# EAGLE design 165EVAL_REV.B (EAGLE 6.6.0)
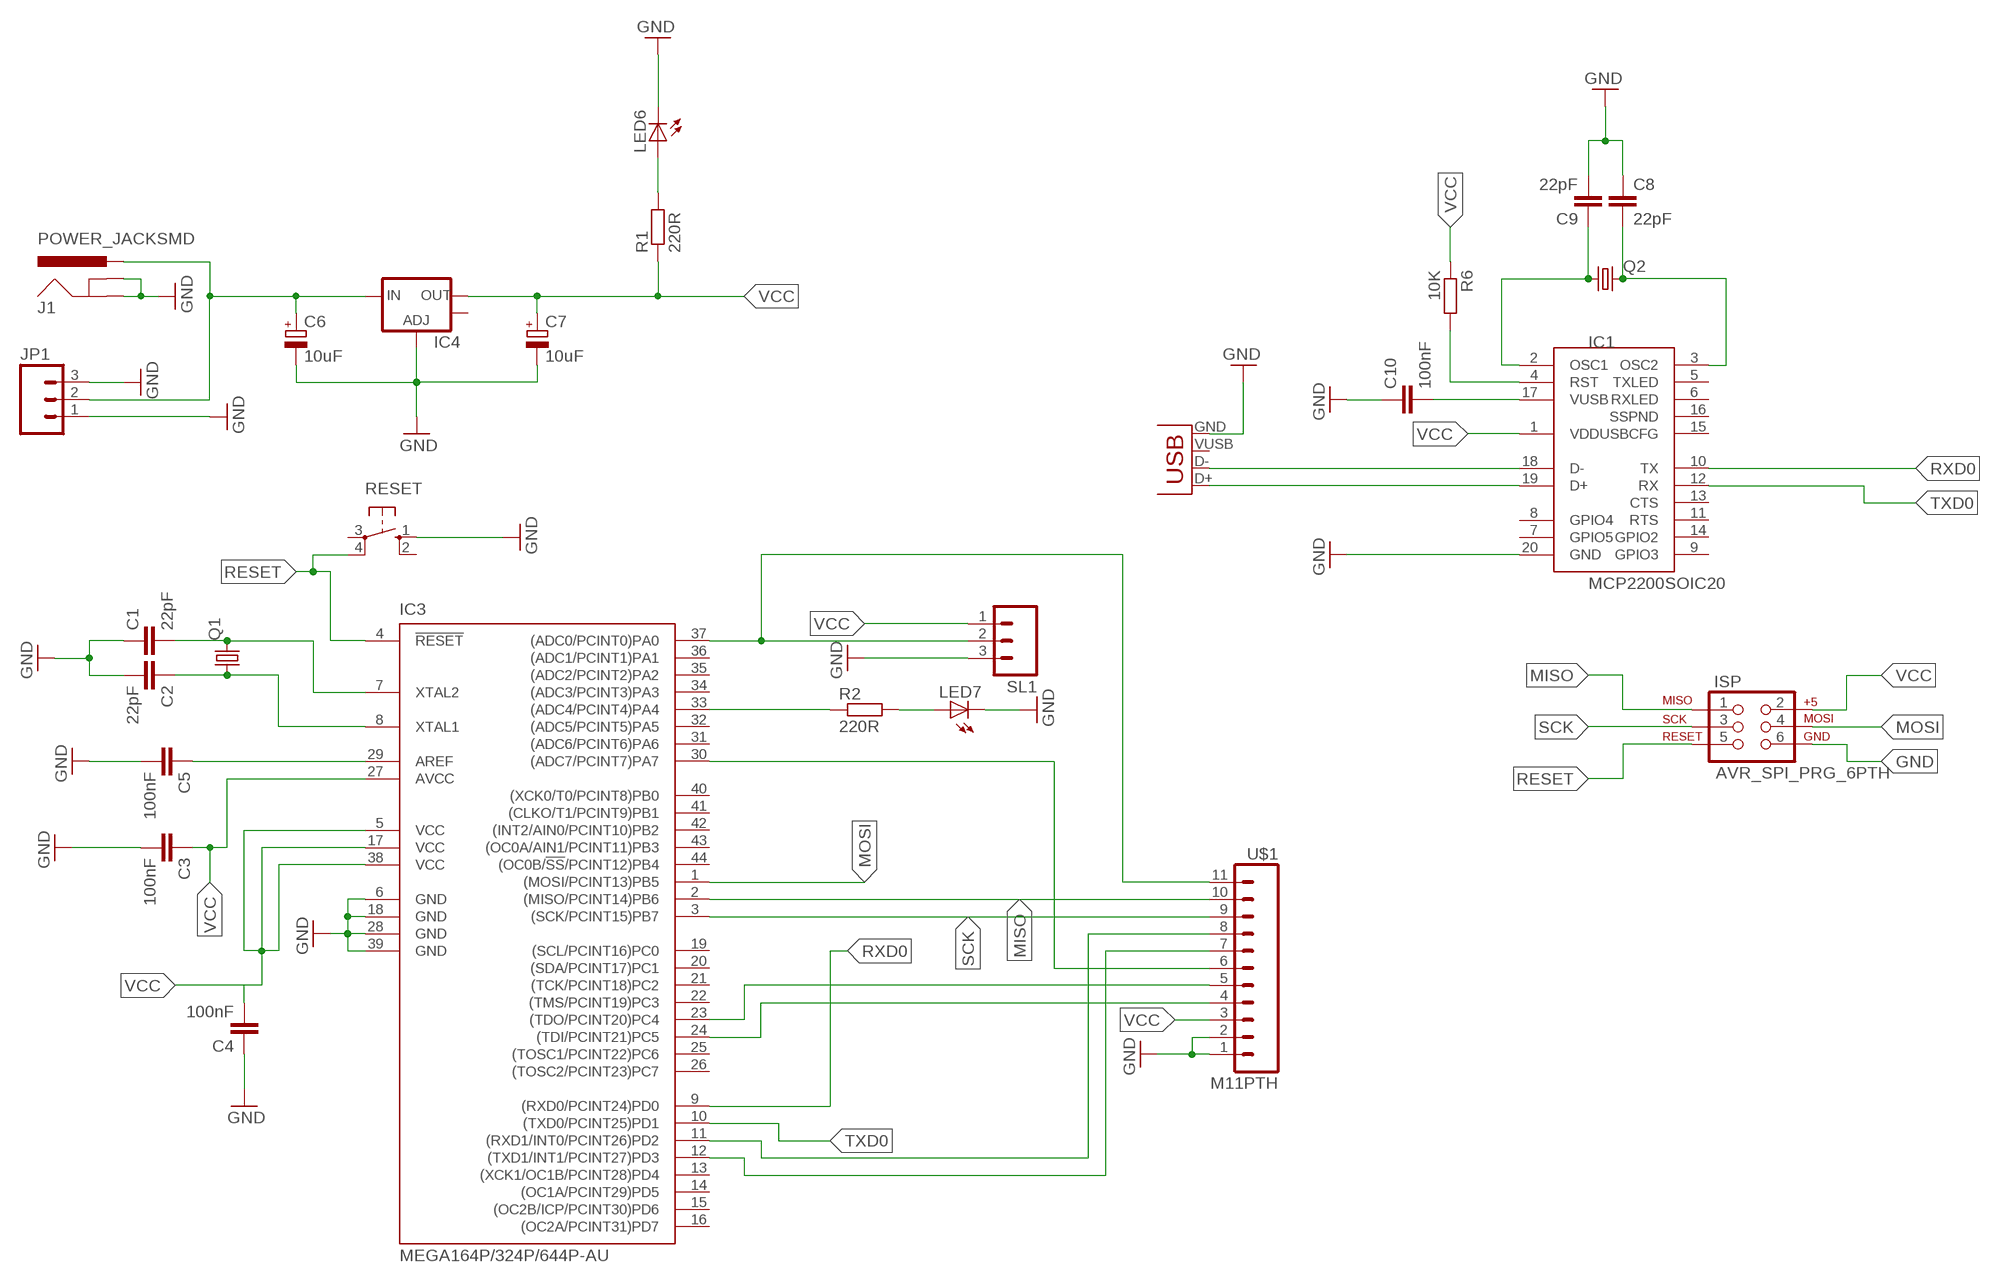
[diagram p0: schematic, sheet 1]

## Parts
C1  22pF  C-EUC0805K  [C0805K]
C2  22pF  C-EUC0805K  [C0805K]
C3  100nF  C-EUC0805K  [C0805K]
C4  100nF  C-EUC0805K  [C0805K]
C5  100nF  C-EUC0805K  [C0805K]
C6  10uF  CPOL-EUCT6032  [CT6032]
C7  10uF  CPOL-EUCT6032  [CT6032]
C8  22pF  C-EUC0805K  [C0805K]
C9  22pF  C-EUC0805K  [C0805K]
C10  100nF  C-EUC0805K  [C0805K]
IC1  MCP2200SOIC20  [SOIC20]
IC3  MEGA164P/324P/644P-AU  [TQFP44]
IC4  V_REG_LM1117SOT223  [SOT223]
ISP  AVR_SPI_PRG_6PTH  [2X3]
J1  POWER_JACKSMD  [POWER_JACK_SMD]
JP1  M03PTH  [1X03]
LED6  LEDSMT1206  [1206]
LED7  LEDSMT1206  [1206]
Q1  CRYSTALSM49  [SM49]
Q2  CRYSTALSM49  [SM49]
R1  220R  R-EU_R1206  [R1206]
R2  220R  R-EU_R1206  [R1206]
R6  10K  R-EU_R1206  [R1206]
RESET  10-XX  [B3F-10XX]
SL1  M03  [03P]
U$1  M11PTH  [1X11]
USB  USB-B-S  [USB-B-SMT]

## Nets
GND: C1.1 C2.2 C3.2 C4.1 C5.2 C6.- C7.- C8.1 C9.2 C10.1 IC1.20(GND) IC3.6(GND) IC3.18(GND) IC3.28(GND) IC3.39(GND) IC4.1(ADJ) ISP.6 J1.GND(GNDBREAK) J1.P$4(GND) JP1.1 JP1.3 LED6.C LED7.C RESET.1(S) SL1.3 U$1.1 U$1.2 USB.GND
MISO: IC3.2((MISO/PCINT14)PB6) ISP.1 U$1.10
MOSI: IC3.1((MOSI/PCINT13)PB5) ISP.4
N$1: C1.2 IC3.7(XTAL2) Q1.2
N$2: C2.1 IC3.8(XTAL1) Q1.1
N$3: C8.2 IC1.3(OSC2) Q2.2
N$4: C9.1 IC1.2(OSC1) Q2.1
N$5: IC3.37((ADC0/PCINT0)PA0) SL1.2 U$1.11
N$6: C5.1 IC3.29(AREF)
N$7: C10.2 IC1.17(VUSB)
N$9: IC1.18(D-) USB.D-
N$10: IC1.19(D+) USB.D+
N$11: IC1.4(RST) R6.2
N$12: IC3.33((ADC4/PCINT4)PA4) R2.1
N$13: IC3.11((RXD1/INT0/PCINT26)PD2) U$1.8
N$14: IC3.12((TXD1/INT1/PCINT27)PD3) U$1.7
N$15: IC3.30((ADC7/PCINT7)PA7) U$1.6
N$16: IC3.23((TDO/PCINT20)PC4) U$1.5
N$17: IC3.24((TDI/PCINT21)PC5) U$1.4
N$30: C6.+ IC4.3(IN) J1.VIN0(PWR) JP1.2
N$36: LED6.A R1.2
N$37: LED7.A R2.2
RESET: IC3.4(!RESET) ISP.5 RESET.4(P1)
RXD0: IC1.10(TX) IC3.9((RXD0/PCINT24)PD0)
SCK: IC3.3((SCK/PCINT15)PB7) ISP.3 U$1.9
TXD0: IC1.12(RX) IC3.10((TXD0/PCINT25)PD1)
VCC: C3.1 C4.2 C7.+ IC1.1(VDD) IC3.5(VCC) IC3.17(VCC) IC3.27(AVCC) IC3.38(VCC) IC4.2(OUT) ISP.2 R1.1 R6.1 SL1.1 U$1.3
Unconnected: IC1.5(TXLED) IC1.6(RXLED) IC1.7(GPIO5) IC1.8(GPIO4) IC1.9(GPIO3) IC1.11(RTS) IC1.13(CTS) IC1.14(GPIO2) IC1.15(USBCFG) IC1.16(SSPND) IC3.13((XCK1/OC1B/PCINT28)PD4) IC3.14((OC1A/PCINT29)PD5) IC3.15((OC2B/ICP/PCINT30)PD6) IC3.16((OC2A/PCINT31)PD7) IC3.19((SCL/PCINT16)PC0) IC3.20((SDA/PCINT17)PC1) IC3.21((TCK/PCINT18)PC2) IC3.22((TMS/PCINT19)PC3) IC3.25((TOSC1/PCINT22)PC6) IC3.26((TOSC2/PCINT23)PC7) IC3.31((ADC6/PCINT6)PA6) IC3.32((ADC5/PCINT5)PA5) IC3.34((ADC3/PCINT3)PA3) IC3.35((ADC2/PCINT2)PA2) IC3.36((ADC1/PCINT1)PA1) IC3.40((XCK0/T0/PCINT8)PB0) IC3.41((CLKO/T1/PCINT9)PB1) IC3.42((INT2/AIN0/PCINT10)PB2) IC3.43((OC0A/AIN1/PCINT11)PB3) IC3.44((OC0B/!SS!/PCINT12)PB4) IC4.4(OUT) RESET.2(S1) RESET.3(P) USB.VUSB(VBUS)

## Library data of the parts
C1-C5 C8-C10 = rcl:C-EU: CAPACITOR, European symbol
C6 C7 = resistor:CPOL-EU: POLARIZED CAPACITOR, European symbol
IC1 = microchip-update-2:MCP2200: USB 2.0 to UART Protocol Converter with GPIO
IC3 = avr-7:MEGA164P/324P/644P-AU
IC4 = SparkFun:V_REG_LM1117: Voltage Regulator LM1117 Standard adjustable voltage regulator but in SMD form. Spark Fun Electronics SKU : COM-00595
ISP = SparkFun:AVR_SPI_PRG_6: AVR ISP 6 Pin This is the reduced ISP connector for AVR programming. Common on Arduino. This footprint will take up less PCB space and can be used with a 10-pin to 6-pin adapter such as SKU: BOB-08508
J1 = SparkFun:POWER_JACK: Power Jack This is the standard 5.5mm barrel jack for power. The PTH is the most common, proven, reliable, footprint. All others are experimental. The Slot footprint only works if the mill layer is transmitted to the PCB fab house so be warned. Spark Fun Electronics SKU : PRT-00119. Mating wall wart : TOL-00298 (and others)
JP1 = SparkFun:M03: Header 3 Standard 3-pin 0.1" header. Use with straight break away headers (SKU : PRT-00116), right angle break away headers (PRT-00553), swiss pins (PRT-00743), machine pins (PRT-00117), and female headers (PRT-00115). Molex polarized connector foot print use with SKU : PRT-08232 with associated crimp pins and housings.
LED6 LED7 = led:LED: LED OSRAM: - CHIPLED LG R971, LG N971, LY N971, LG Q971, LY Q971, LO R971, LY R971 LH N974, LH R974 LS Q976, LO Q976, LY Q976 LO Q996 - Hyper CHIPLED LW Q18S LB Q993, LB Q99A, LB R99A - SideLED LS A670, LO A670, LY A670, LG A670, LP A670 LB A673, LV A673, LT A673, LW A673 LH A674 LY A675 LS A676, LA A676, LO A676, LY A676, LW A676 LS A679, LY A679, LG A679 - Hyper Micro SIDELED® LS Y876, LA Y876, LO Y876, LY Y876 LT Y87S - SmartLED LW L88C, LW L88S LB L89C, LB L89S, LG L890 LS L89K, LO L89K, LY L89K LS L896, LA L896, LO L896, LY L896 - TOPLED LS T670, LO T670, LY T670, LG T670, LP T670 LSG T670, LSP T670, LSY T670, LOP T670, LYG T670 LG T671, LOG T671, LSG T671 LB T673, LV T673, LT T673, LW T673 LH T674 LS T676, LA T676, LO T676, LY T676, LB T676, LH T676, LSB T676, LW T676 LB T67C, LV T67C, LT T67C, LS T67K, LO T67K, LY T67K, LW E67C LS E67B, LA E67B, LO E67B, LY E67B, LB E67C, LV E67C, LT E67C LW T67C LS T679, LY T679, LG T679 LS T770, LO T770, LY T770, LG T770, LP T770 LB T773, LV T773, LT T773, LW T773 LH T774 LS E675, LA E675, LY E675, LS T675 LS T776, LA T776, LO T776, LY T776, LB T776 LHGB T686 LT T68C, LB T68C - Hyper Mini TOPLED® LB M676 - Mini TOPLED Santana® LG M470 LS M47K, LO M47K, LY M47K Source: http://www.osram.convergy.de LUXEON: - LUMILED® LXK2-PW12-R00, LXK2-PW12-S00, LXK2-PW14-U00, LXK2-PW14-V00 LXK2-PM12-R00, LXK2-PM12-S00, LXK2-PM14-U00 LXK2-PE12-Q00, LXK2-PE12-R00, LXK2-PE12-S00, LXK2-PE14-T00, LXK2-PE14-U00 LXK2-PB12-K00, LXK2-PB12-L00, LXK2-PB12-M00, LXK2-PB14-N00, LXK2-PB14-P00, LXK2-PB14-Q00 LXK2-PR12-L00, LXK2-PR12-M00, LXK2-PR14-Q00, LXK2-PR14-R00 LXK2-PD12-Q00, LXK2-PD12-R00, LXK2-PD12-S00 LXK2-PH12-R00, LXK2-PH12-S00 LXK2-PL12-P00, LXK2-PL12-Q00, LXK2-PL12-R00 Source: www.luxeon.com KINGBRIGHT: KA-3528ASYC Source: www.kingbright.com
Q1 Q2 = crystal:CRYSTAL: CRYSTAL; OC_FARNELL: unknown; OC_NEWARK: unknown
R1 R2 R6 = resistor:R-EU_: RESISTOR, European symbol
RESET = switch-omron:10-XX: OMRON SWITCH; MPN: B3F-1000; OC_FARNELL: 176432; OC_NEWARK: 36M3542
SL1 = con-amp-quick:M03: AMP QUICK CONNECTOR; OC_FARNELL: unknown; OC_NEWARK: unknown
U$1 = SparkFun-3-2-07:M11: Header 11 Standard 11-pin 0.1" header. Use with straight break away headers (SKU : PType-HD), right angle break away headers (PType-HD-RightAngle), swiss pins (PType-30F), machine pins (PType-MP), and female headers (PType-FH). Molex polarized connector foot print use with SKU : Con-Hdr with associated crimp pins and housings.
USB = SparkFun:USB: USB Connectors USB-B-PTH is fully proven SKU : PRT-00139 USB-miniB is fully proven SKU : PRT-00587 USB-A-PCB is untested. USB-A-H is throughly reviewed, but untested. Spark Fun Electronics SKU : PRT-00437 USB-B-SMT is throughly reviewed, but untested. Needs silkscreen touching up. USB-A-S has not been used/tested USB-MB-H has not been used/tested

## Net classes
1 vcc: width 0.254 mm

## Board
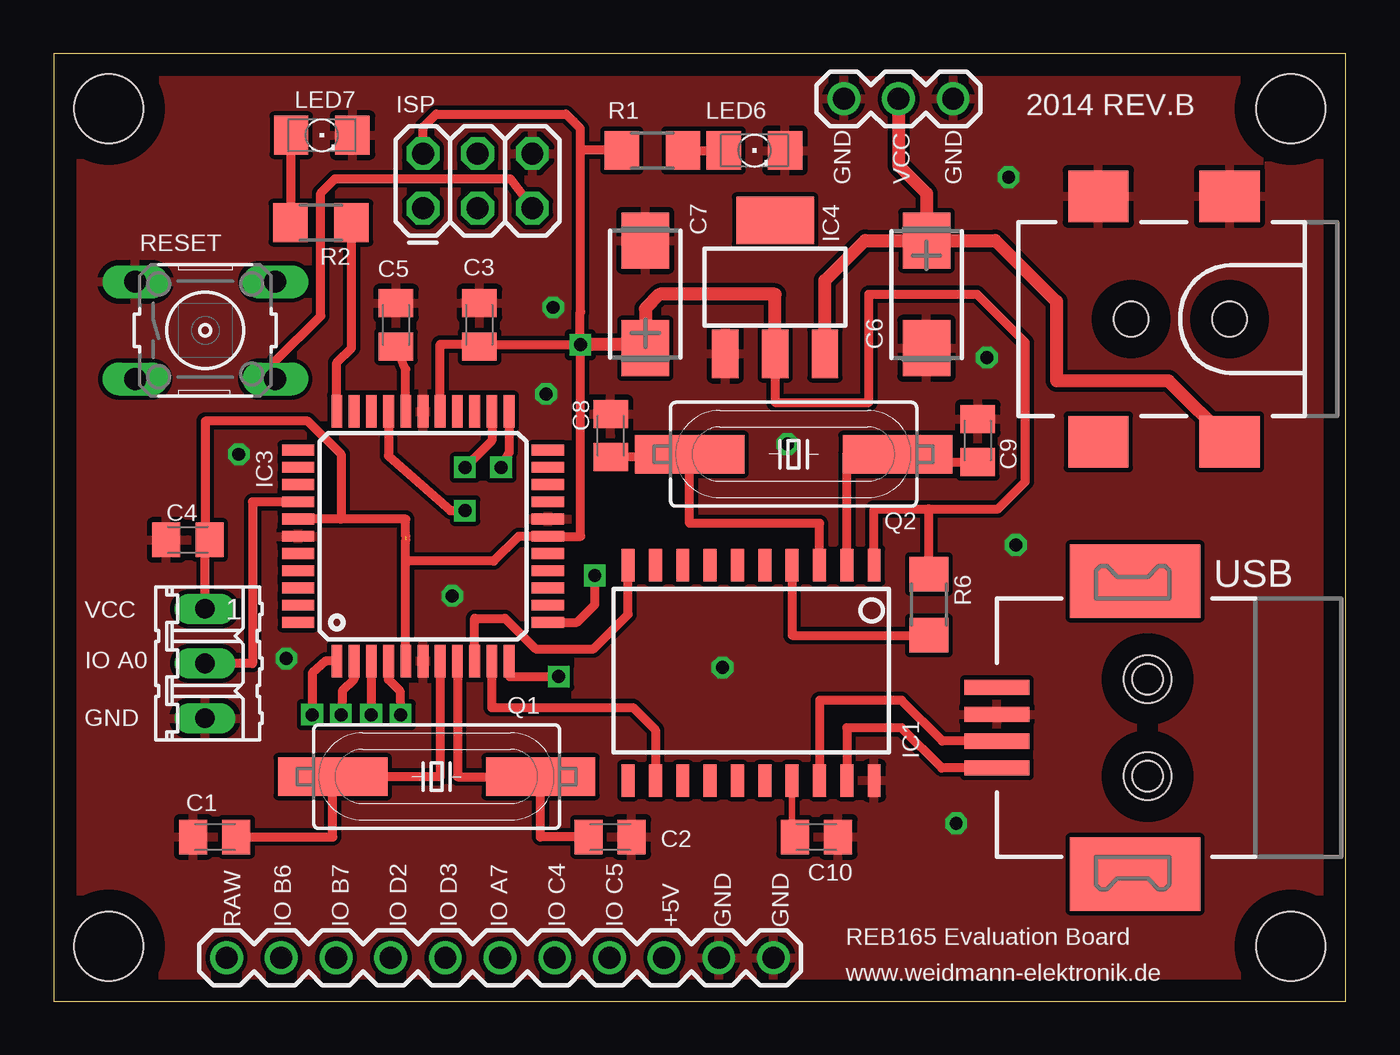
[diagram p1: board, top side]
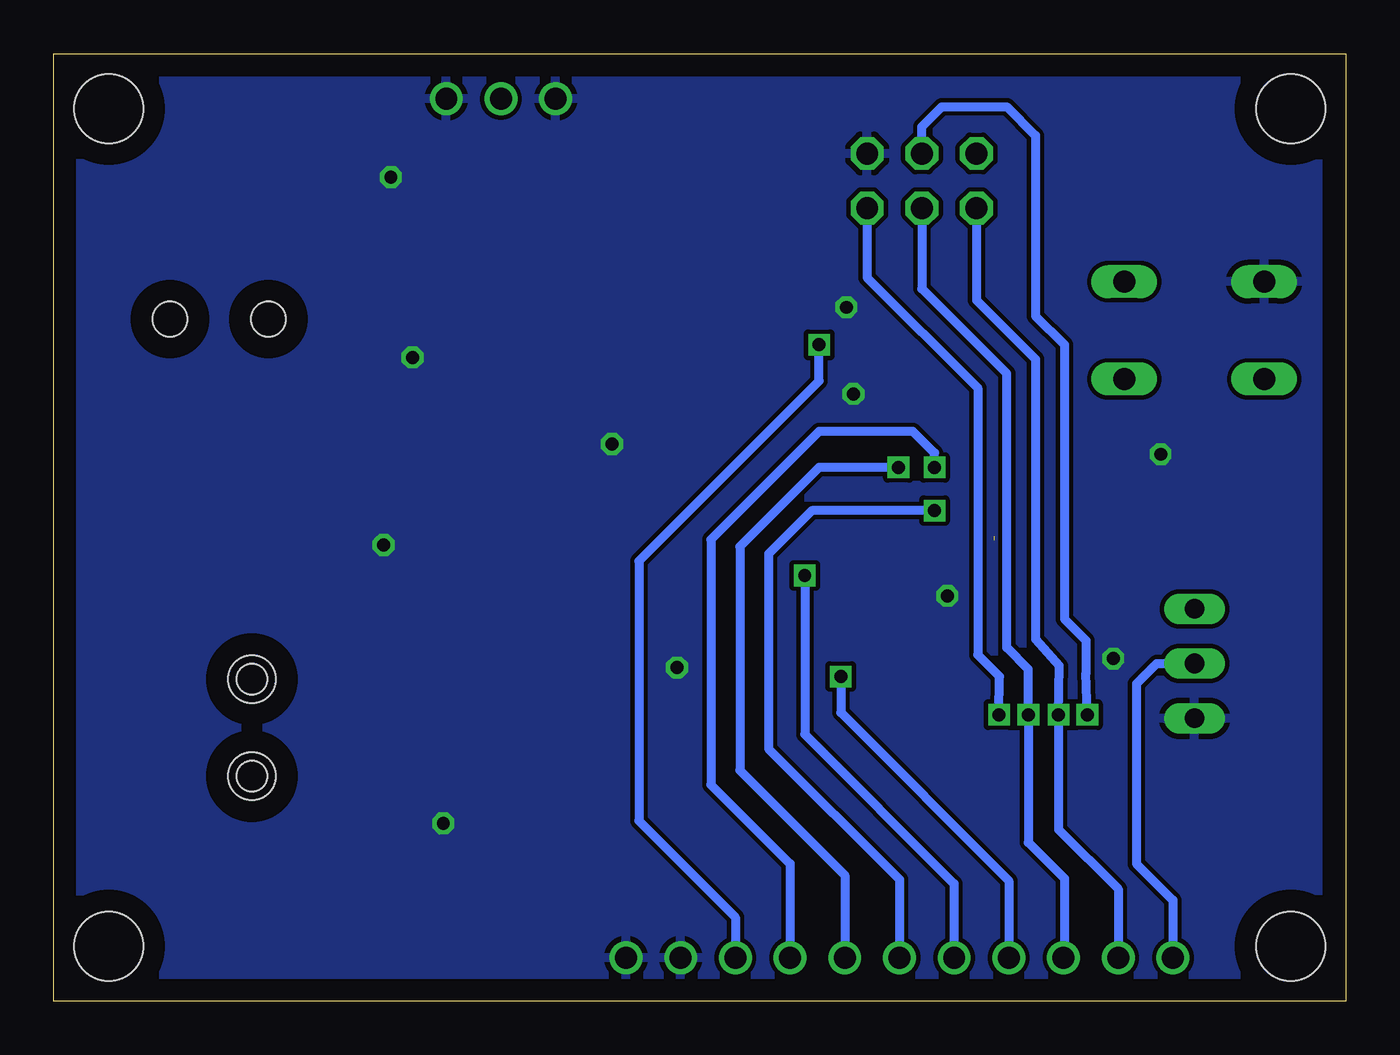
[diagram p2: board, bottom side, seen from below]

Size 60 x 44 mm. Coordinates in mm from the lower left corner, seen from the top.
Outline: 0,0 60,0 60,44 0,44 0,0
Copper layers (1*16): Top 0.035mm / dielectric 1.5mm / Bottom 0.035mm
Design rules "default": minimum track width 10mil, minimum drill 24mil, track to track 8mil, track to pad 8mil, pad to pad 8mil, via to via 8mil, smd to smd 8mil, copper to edge 40mil, drill to drill 8mil, minimum pad ring 10mil, minimum via ring 8mil, stop-mask expansion 4mil, vias tented up to drill 0mil, thermal gap 10mil
Holes 3.2 mm at 57.46,2.54 2.54,2.54 2.54,41.46 57.46,41.46
Holes 2.2 mm at 50.8,14.95 50.8,10.45

### Footprints (pad centres in the part's own frame; a part is rotated, then mirrored left to right if it is on the bottom)
C0805K = smd 1.3 x 1.6: 1 -1,0; 2 1,0
CT6032 = smd 2.6 x 2.2: + 2.5,0; - -2.5,0
SOIC20 = smd 0.6 x 1.5: 1 -5.715,-5; 2 -4.445,-5; 3 -3.175,-5; 4 -1.905,-5; 5 -0.635,-5; 6 0.635,-5; 7 1.905,-5; 8 3.175,-5; 9 4.445,-5; 10 5.715,-5; 11 5.715,5; 12 4.445,5; 13 3.175,5; 14 1.905,5; 15 0.635,5; 16 -0.635,5; 17 -1.905,5; 18 -3.175,5; 19 -4.445,5; 20 -5.715,5
TQFP44 = smd 1.5 x 0.5: 1 -5.8,4; 2 -5.8,3.2; 3 -5.8,2.4; 4 -5.8,1.6; 5 -5.8,0.8; 6 -5.8,0; 7 -5.8,-0.8; 8 -5.8,-1.6; 9 -5.8,-2.4; 10 -5.8,-3.2; 11 -5.8,-4; 23 5.8,-4; 24 5.8,-3.2; 25 5.8,-2.4; 26 5.8,-1.6; 27 5.8,-0.8; 28 5.8,0; 29 5.8,0.8; 30 5.8,1.6; 31 5.8,2.4; 32 5.8,3.2; 33 5.8,4 | smd 0.5 x 1.5: 12 -4,-5.8; 13 -3.2,-5.8; 14 -2.4,-5.8; 15 -1.6,-5.8; 16 -0.8,-5.8; 17 0,-5.8; 18 0.8,-5.8; 19 1.6,-5.8; 20 2.4,-5.8; 21 3.2,-5.8; 22 4,-5.8; 34 4,5.8; 35 3.2,5.8; 36 2.4,5.8; 37 1.6,5.8; 38 0.8,5.8; 39 0,5.8; 40 -0.8,5.8; 41 -1.6,5.8; 42 -2.4,5.8; 43 -3.2,5.8; 44 -4,5.8
SOT223 = smd 1.219 x 2.235: 1 -2.311,-3.099; 2 0,-3.099; 3 2.311,-3.099 | smd 3.6 x 2.2: 4 0,3.099
2X3 = drill 1.016 octagon: 1 0,0; 2 0,2.54; 3 2.54,0; 4 2.54,2.54; 5 5.08,0; 6 5.08,2.54
POWER_JACK_SMD = smd 2.8 x 2.4: GND 0,-5.7; P$4 6.1,-5.7; VIN0 0,5.7; VIN1 6.1,5.7 | hole 1.6: 0,0; 4.572,0
1X03 = drill 1.016: 1 0,0; 2 2.54,0; 3 5.08,0
1206 = smd 1.6 x 1.803: A -1.422,0; C 1.422,0
SM49 = smd 5.08 x 1.778: 1 -4.826,0; 2 4.826,0
R1206 = smd 1.6 x 1.803: 1 -1.422,0; 2 1.422,0
B3F-10XX = drill 1.016 long: 1 -3.251,2.261; 2 3.251,2.261; 3 -3.251,-2.261; 4 3.251,-2.261
03P = drill 0.914 long: 1 -2.54,0; 2 0,0; 3 2.54,0
1X11 = drill 1.016: 1 0,0; 2 2.54,0; 3 5.08,0; 4 7.62,0; 5 10.16,0; 6 12.7,0; 7 15.24,0; 8 17.78,0; 9 20.32,0; 10 22.86,0; 11 25.4,0
USB-B-SMT = smd 6.04 x 3.4: 5 0.58,6.8; 6 0.58,-6.8 | smd 3 x 0.7: D+ 7,1.875; D- 7,0.625; GND 7,-0.625; VUSB 7,-1.875 | hole 1.4: 0,2.25; 0,-2.25

### Placement (x,y rotation side)
C1  7.48,7.62 0 top
C2  25.84,7.62 0 top
C3  19.77,31.41 90 top
C4  6.23,21.43 0 top
C5  15.89,31.41 90 top
C6  40.53,32.83 90 top
C7  27.47,32.83 270 top
C8  25.86,26.26 270 top
C9  42.91,26.04 90 top
C10  35.42,7.62 180 top
IC1  32.38,15.24 180 top
IC3  17.14,21.59 90 top
IC4  33.5,33.16 0 top
ISP  17.14,36.83 0 top
J1  54.61,31.68 180 top
JP1  36.69,41.91 0 top
LED6  32.55,39.51 0 top
LED7  12.45,40.22 0 top
Q1  17.78,10.43 180 top
Q2  34.36,25.4 180 top
R1  27.8,39.51 0 top
R2  12.4,36.16 180 top
R6  40.64,18.41 270 top
RESET  7.04,31.16 0 top
SL1  7.02,15.68 270 top
U$1  33.42,2.01 180 top
USB  50.8,12.7 180 top

### Tracks (layer width: path | path; a pad name or v marks a point on that pad's centre or on a via)
GND  (via drill 0.6)
  other vias: 8.59,25.4 41.91,8.26 44.68,21.18 22.86,28.2 10.79,15.91 23.2,32.23 18.5,18.82 34.08,25.88 31.06,15.49 44.34,38.27 43.34,29.89
  pour Top: 1.27,43.18 59.02,43.18 59.02,0.67 1.27,0.67
  pour Bottom: 1.27,43.18 59.05,43.18 59.05,0.64 1.27,0.64
MISO  (via drill 0.6)
  Top 0.406: IC3.2 13.95,14.95 13.4,14.4 13.4,14.04 v13.34,13.3
  Bottom 0.406: ISP.1 17.14,32.55 14.4,29.82 14.4,16.82 13.3,15.57 v13.34,13.3 13.34,7.97 10.56,5.21 U$1.10
MOSI  (via drill 0.6)
  Top 0.406: IC3.1 12.62,15.79 12,15.24 v12,13.3
  Bottom 0.406: v12,13.3 12.06,15.24 12.06,16.75 13.06,17.75 13.06,30.48 14.4,31.82 14.4,40.2 15.74,41.54 18.76,41.54 19.68,40.62 ISP.4
N$1
  Top 0.406: IC3.7 17.95,10.43 Q1.2 12.95,7.62 C1.2
N$2
  Top 0.406: IC3.8 18.75,10.43 Q1.1 22.61,7.62 C2.1
N$3
  Top 0.406: IC1.3 35.56,22.19 29.53,22.19 Q2.2 27.94,25.4 27.8,25.26 C8.2
N$4
  Top 0.406: IC1.2 36.83,25.4 Q2.1 37.85,25.04 C9.1
N$5
  Top 0.406: IC3.37 9.22,23.19 9.22,15.68 SL1.2
  Bottom 0.406: SL1.2 8.78,15.68 9.71,14.74 9.71,6.38 8.03,4.69 U$1.11
N$6
  Top 0.406: IC3.29 16.34,29.34 C5.1
N$7
  Top 0.305: C10.2 34.29,7.62 IC1.17
N$9
  Top 0.406: USB.D- 41.27,12.07 39.37,13.97 35.56,13.97 IC1.18
N$10
  Top 0.406: USB.D+ 41.24,10.82 39.37,12.7 36.83,12.7 IC1.19
N$11
  Top 0.406: IC1.4 34.29,16.99 R6.2
N$12
  Top 0.406: IC3.33 13.14,29.66 13.82,30.33 R2.1
N$13  (via drill 0.6)
  Top 0.406: IC3.11 21.19,15.07 v23.45,15.07
  Bottom 0.406: v23.45,15.07 23.45,13.4 15.64,5.59 U$1.8
N$14  (via drill 0.6)
  Top 0.406: IC3.12 24.29,17.59 25.12,18.43 v25.12,19.77
  Bottom 0.406: v25.12,19.77 25.12,12.39 18.18,5.46 U$1.7
N$15  (via drill 0.6)
  Top 0.406: IC3.30 15.54,25.32 18.43,22.78 v19.09,22.78
  Bottom 0.406: v19.09,22.78 24.79,22.78 26.8,20.77 26.8,11.72 20.73,5.65 U$1.6
N$16  (via drill 0.6)
  Top 0.406: IC3.23 21.14,25.5 v20.77,24.79
  Bottom 0.406: U$1.5 23.27,5.84 28.14,10.72 28.14,21.11 24.45,24.79 v20.77,24.79
N$17  (via drill 0.6)
  Top 0.406: IC3.24 20.34,26.04 v19.09,24.79
  Bottom 0.406: v19.09,24.79 19.09,25.46 20.1,26.46 24.45,26.46 29.48,21.44 29.48,10.05 25.8,6.38 U$1.4
N$30
  Top 0.61: JP1.2 39.23,38.83 40.53,37.52 C6.+ | J1.VIN0 51.78,28.81 46.56,28.81 46.56,32.49 43.73,35.33 C6.+ | IC4.3 35.81,33.47 37.67,35.33 C6.+
N$36
  Top 0.406: R1.2 LED6.A
N$37
  Top 0.406: R2.2 11.02,36.2 LED7.A
RESET  (via drill 0.6)
  Top 0.406: IC3.4 15.54,14.94 16.08,14.4 v16.1,13.3 | ISP.5 21.2,38.19 13.06,38.19 12.39,37.52 12.39,31.82 10.29,29.72 RESET.4
  Bottom 0.406: v16.1,13.3 16.08,15.07 17.09,16.08 17.09,28.48 22.23,33.62 ISP.5
RXD0
  Top 0.406: IC3.9 19.55,17.78 20.95,17.78 22.38,16.36 25.07,16.36 26.67,17.96 IC1.10
SCK  (via drill 0.6)
  Top 0.406: IC3.3 14.74,14.07 v14.74,13.3
  Bottom 0.406: ISP.3 19.68,33.09 15.74,29.14 15.74,16.41 14.74,15.41 v14.74,13.3 | v14.74,13.3 14.79,13.24 | v14.74,13.3 14.74,7.37 13.06,5.7 13.06,2.05 U$1.9
TXD0
  Top 0.406: IC3.10 20.34,13.63 26.9,13.63 27.94,12.6 IC1.12
VCC  (via drill 0.6)  (1 unrouted)
  Top 0.406: 16.34,21.59 16.34,22.39 13.34,22.39 | 13.34,22.39 IC3.38 | 13.34,22.39 13.34,25.4 11.79,26.94 7.04,26.94 7.04,21.62 C4.2 7.02,21.21 SL1.1 | IC1.1 38.1,22.86 40.64,22.86 | 40.64,22.86 43.85,22.86 45.12,24.13 45.12,30.59 42.88,32.83 37.85,32.83 37.85,27.8 33.5,27.8 IC4.2 | R6.1 40.64,22.86 | IC3.5 16.34,20.43 | 16.34,20.43 16.34,21.43 | ISP.2 17.14,40.59 17.75,41.2 23.79,41.2 24.14,40.85 24.45,40.52 24.45,39.53 | v24.45,30.48 24.45,32.01 24.46,32.01 24.45,33.02 24.45,39.53 | R1.1 26.36,39.53 24.45,39.53 | 16.34,20.43 20.43,20.43 21.59,21.59 IC3.17 24.46,21.59 24.46,30.48 v24.45,30.48 | 24.45,30.51 v24.45,30.48 | IC3.27 17.95,30.51 19.77,30.51 C3.1 19.84,30.48 v24.45,30.48
  Top 0.61: IC4.2 33.5,32.83 28.14,32.83 27.47,32.16 C7.+ 27.29,30.48 v24.45,30.48
  Bottom 0.406: v24.45,30.48 24.45,28.81 32.83,20.43 32.83,8.38 28.34,3.89 U$1.3

### Text on the board
tPlace: GND | VCC | GND | VCC | IO A0 | GND | RAW | IO B6 | IO B7 | IO D2 | IO D3 | IO A7 | IO C4 | IO C5 | +5V | GND | GND
tNames: 2014 REV.B | REB165 Evaluation Board | www.weidmann-elektronik.de